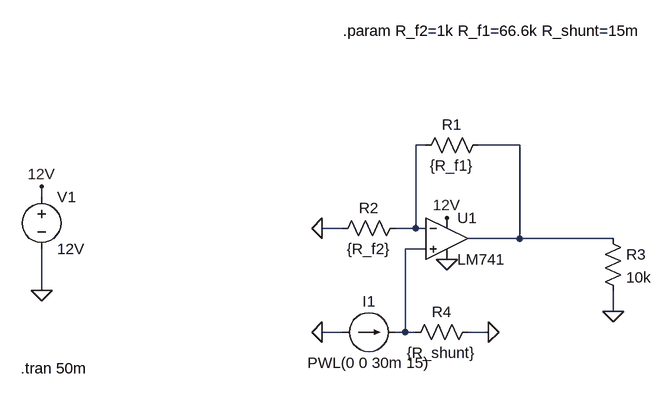
[diagram p0: schematic lm741_noninverting_amplifier.asc]
lm741_noninverting_amplifier.asc, the LTspice schematic file:
Version 4
SHEET 1 988 680
WIRE 128 0 112 0
WIRE 272 0 208 0
WIRE -464 80 -464 64
WIRE 0 128 -32 128
WIRE 112 128 112 0
WIRE 112 128 80 128
WIRE 128 128 112 128
WIRE 272 144 272 0
WIRE 272 144 192 144
WIRE 416 144 272 144
WIRE 128 160 96 160
WIRE -464 224 -464 160
WIRE 416 256 416 224
WIRE 0 288 -32 288
WIRE 96 288 96 160
WIRE 96 288 80 288
WIRE 112 288 96 288
WIRE 224 288 192 288
FLAG -464 224 0
FLAG -464 64 12V
FLAG 160 112 12V
FLAG 160 176 0
FLAG -32 128 0
FLAG 416 256 0
FLAG 224 288 0
FLAG -32 288 0
SYMBOL LM741 160 80 R0
SYMATTR InstName U1
SYMBOL voltage -464 64 R0
WINDOW 123 0 0 Left 0
WINDOW 39 0 0 Left 0
SYMATTR InstName V1
SYMATTR Value 12V
SYMBOL res 224 -16 R90
WINDOW 0 0 56 VBottom 2
WINDOW 3 32 56 VTop 2
SYMATTR InstName R1
SYMATTR Value {R_f1}
SYMBOL res 96 112 R90
WINDOW 0 0 56 VBottom 2
WINDOW 3 32 56 VTop 2
SYMATTR InstName R2
SYMATTR Value {R_f2}
SYMBOL res 400 128 R0
SYMATTR InstName R3
SYMATTR Value 10k
SYMBOL res 208 272 R90
WINDOW 0 0 56 VBottom 2
WINDOW 3 32 56 VTop 2
SYMATTR InstName R4
SYMATTR Value {R_shunt}
SYMBOL current 0 288 R270
WINDOW 0 32 40 VTop 2
WINDOW 3 -32 40 VBottom 2
WINDOW 123 0 0 Left 0
WINDOW 39 0 0 Left 0
SYMATTR InstName I1
SYMATTR Value PWL(0 0 30m 15)
TEXT 0 -176 Left 2 !.param R_f2=1k R_f1=66.6k R_shunt=15m
TEXT -496 344 Left 2 !.tran 50m

The netlist it stands for:
* lm741_noninverting_amplifier.asc
XU1 N003 N001 12V 0 N002 LM741  ; pins In+ In- V+ V- OUT
V1 12V 0 12V
R1 N002 N001 {R_f1}
R2 N001 0 {R_f2}
R3 N002 0 10k
R4 0 N003 {R_shunt}
I1 0 N003 PWL(0 0 30m 15)
.param R_f2=1k R_f1=66.6k R_shunt=15m
.tran 50m
.lib LM741.lib
.backanno
.end